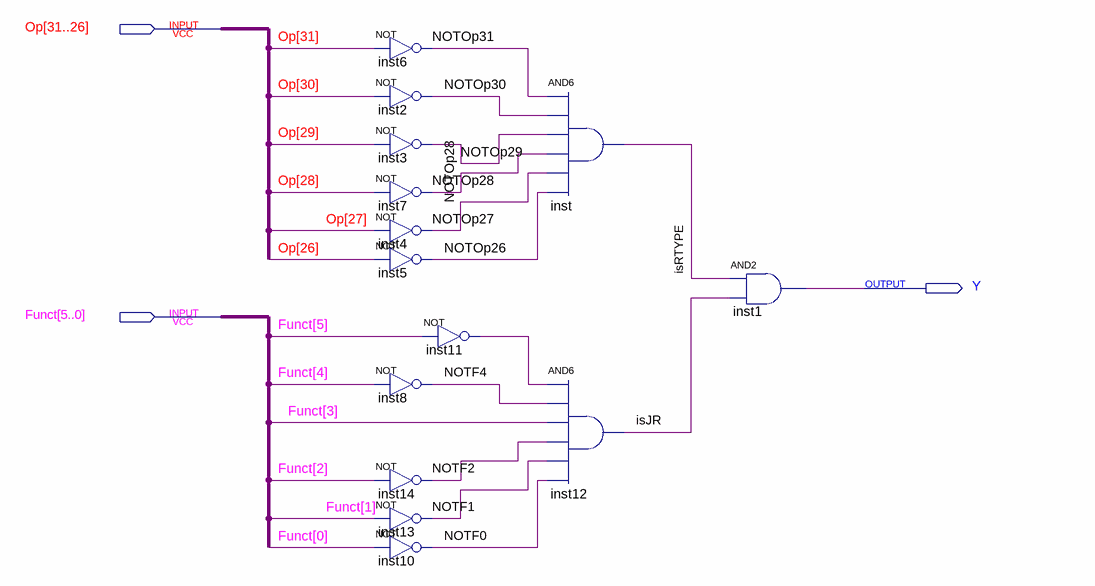
[diagram p0: schematic sheet]
// Quartus schematic JR.bdf as structural Verilog: 14 symbols, 3 pins
module JR (
  input  [31:26] Op,
  input  [5:0] Funct,
  output Y
);

  wire inst11_out, isJR, isRTYPE, NOTF0, NOTF1, NOTF2, NOTF4, NOTOp26, NOTOp27, NOTOp28, NOTOp29, NOTOp30,
       NOTOp31;

  not inst6 (NOTOp31, Op[31]);
  not inst2 (NOTOp30, Op[30]);
  not inst3 (NOTOp29, Op[29]);
  not inst7 (NOTOp28, Op[28]);
  not inst4 (NOTOp27, Op[27]);
  not inst5 (NOTOp26, Op[26]);
  not inst8 (NOTF4, Funct[4]);
  not inst14 (NOTF2, Funct[2]);
  not inst13 (NOTF1, Funct[1]);
  not inst10 (NOTF0, Funct[0]);
  not inst11 (inst11_out, Funct[5]);
  and inst (isRTYPE, NOTOp31, NOTOp30, NOTOp29, NOTOp28, NOTOp27, NOTOp26);
  and inst12 (isJR, inst11_out, NOTF4, Funct[3], NOTF2, NOTF1, NOTF0);
  and inst1 (Y, isRTYPE, isJR);
endmodule
